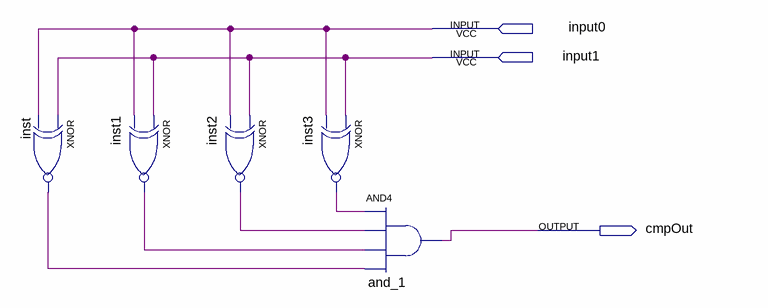
[diagram p0: schematic sheet]
// Quartus schematic EqCmpDemo.bdf as structural Verilog: 5 symbols, 3 pins
module EqCmpDemo (
  input  input0,
  input  input1,
  output cmpOut
);

  wire inst1_out, inst2_out, inst3_out, inst_out;

  xnor inst (inst_out, input1, input0);
  xnor inst1 (inst1_out, input1, input0);
  xnor inst2 (inst2_out, input1, input0);
  xnor inst3 (inst3_out, input1, input0);
  and and_1 (cmpOut, inst3_out, inst2_out, inst1_out, inst_out);
endmodule
